# EAGLE schematic EasterRadio (EAGLE 9.6.1)

## Sheet 1 of 4
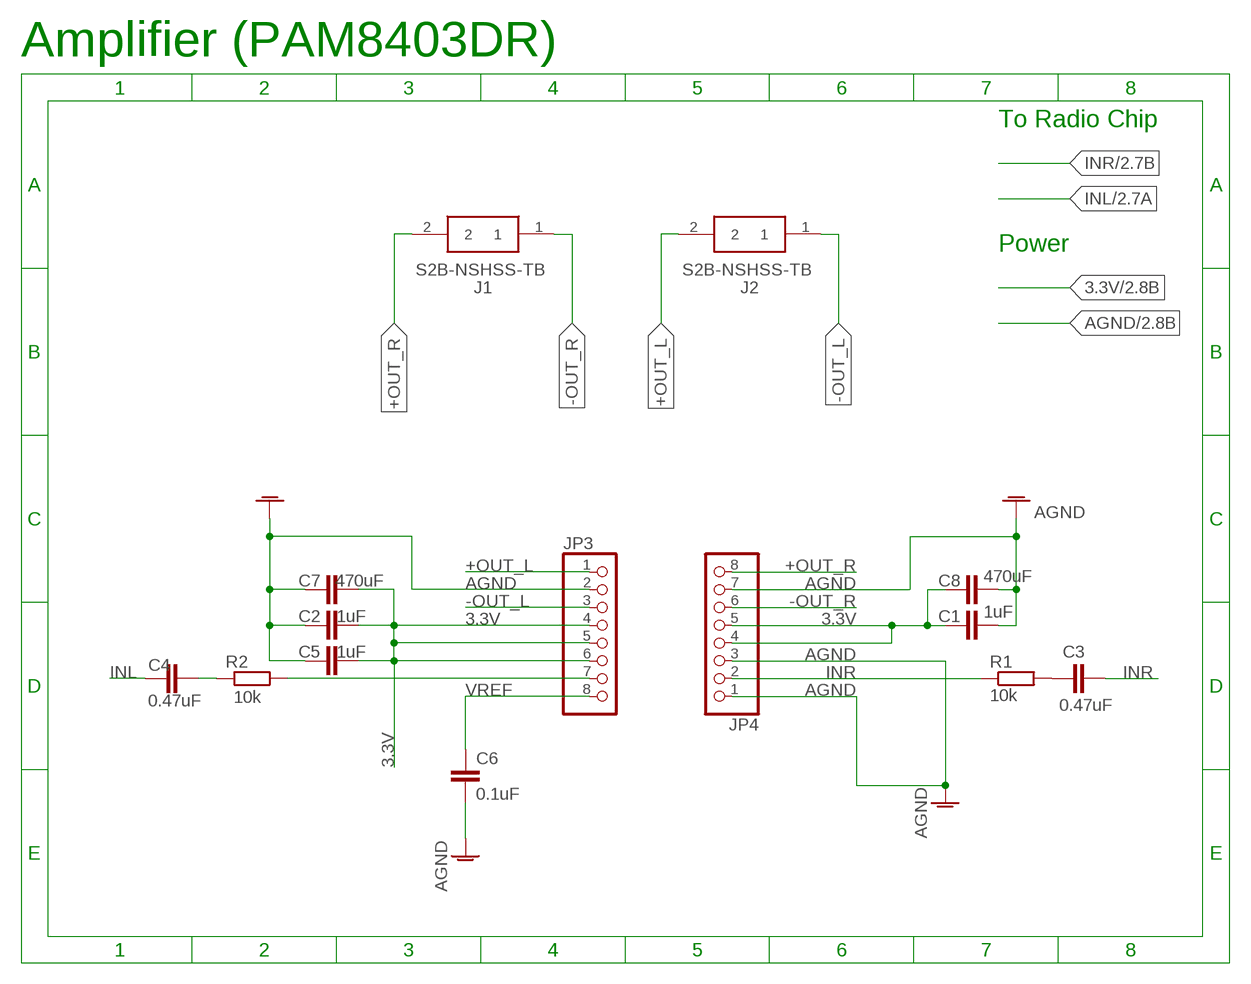
[diagram p0: schematic, sheet 1]

### Parts
C1  1uF  C-EU_805C0805  [C0805]
C2  1uF  C-EU_805C0805  [C0805]
C3  0.47uF  C-EU_805C0805  [C0805]
C4  0.47uF  C-EU_805C0805  [C0805]
C5  1uF  C-EU_805C0805  [C0805]
C6  0.1uF  C-EU_805C0805  [C0805]
C7  470uF  C-EU_805C0805  [C0805]
C8  470uF  C-EU_805C0805  [C0805]
J1  S2B-NSHSS-TB  [SM02B-NSHSS-TB]
J2  S2B-NSHSS-TB  [SM02B-NSHSS-TB]
JP3  PINHD-1X8  [1X08]
JP4  PINHD-1X8  [1X08]
R1  10k  R-EU_805R0805  [R0805]
R2  10k  R-EU_805R0805  [R0805]

### Nets
3.3V: C1.1 C2.2 C5.1 C7.1 C8.2 JP3.4 JP3.5 JP3.6 JP4.4 JP4.5 ; also sheet 2,3,4
+OUT_L: J2.2 JP3.1
+OUT_R: J1.2 JP4.8
-OUT_L: J2.1 JP3.3
-OUT_R: J1.1 JP4.6
AGND: C1.2 C2.1 C5.2 C6.2 C7.2 C8.1 JP3.2 JP4.1 JP4.3 JP4.7 ; also sheet 2,3,4
INL: C4.1 JP3.7 R2.1 ; also sheet 2
INR: C3.2 JP4.2 R1.1 ; also sheet 2
N$1: C3.1 R1.2
N$4: C4.2 R2.2
VREF: C6.1 JP3.8

### Notes on the sheet
- Amplifier (PAM8403DR)
- To Radio Chip
- Power

## Sheet 2 of 4
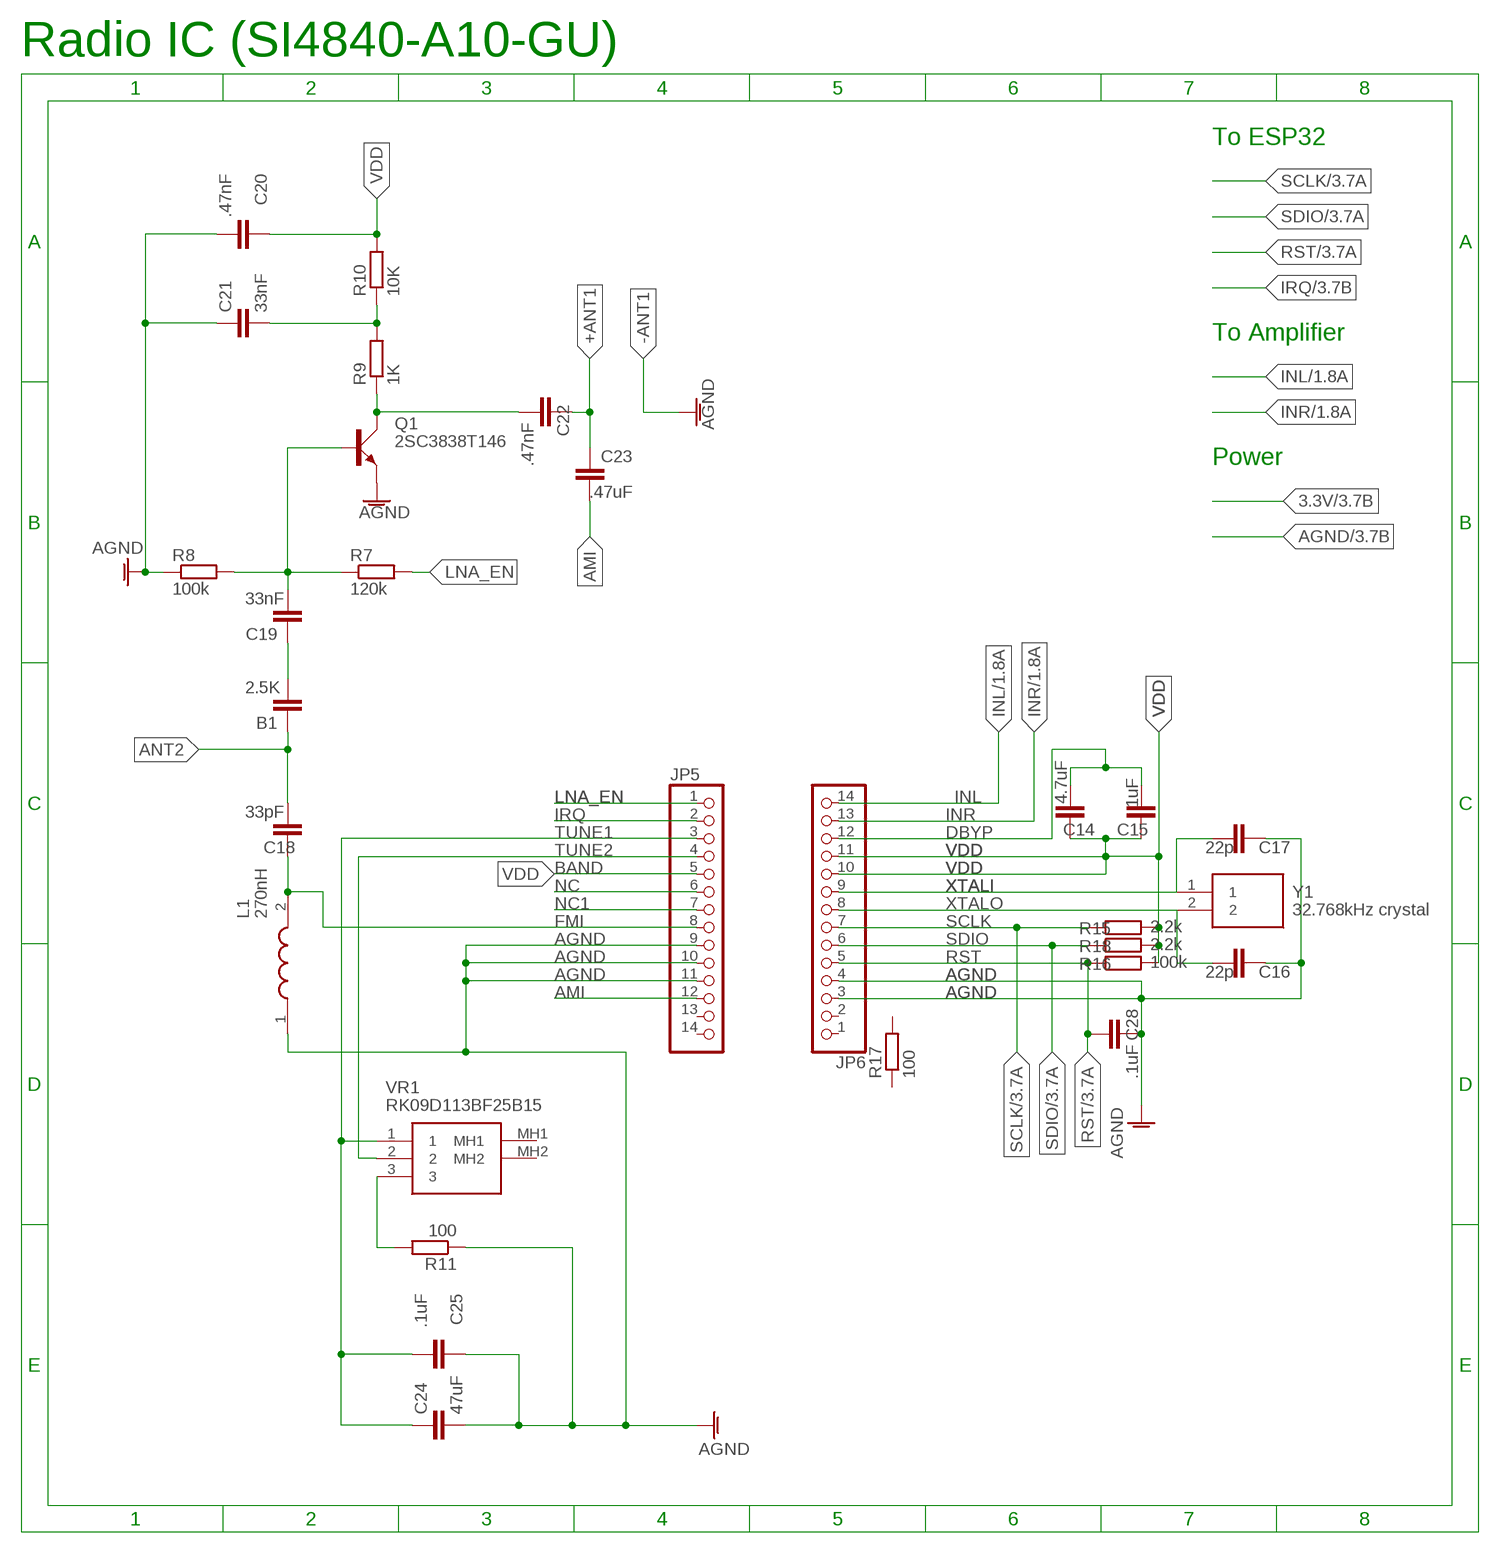
[diagram p1: schematic, sheet 2]

### Parts
B1  2.5K  C-EU_805C0805  [C0805]
C14  4.7uF  C-EU_1206C1206  [C1206]
C15  1uF  C-EU_805C0805  [C0805]
C16  22p  C-EU_805C0805  [C0805]
C17  22p  C-EU_805C0805  [C0805]
C18  33pF  C-EU_805C0805  [C0805]
C19  33nF  C-EU_1206C1206  [C1206]
C20  .47nF  C-EU_805C0805  [C0805]
C21  33nF  CNC5L1X7R1C106K160AEC1206  [C1206]
C22  .47nF  C-EU_805C0805  [C0805]
C23  .47uF  C-EU_805C0805  [C0805]
C24  47uF  CNC5L1X7R1C106K160AEC1206  [C1206]
C25  .1uF  C-EU_805C0805  [C0805]
C28  .1uF  C-EU_805C0805  [C0805]
JP5  PINHD-1X14  [1X14]
JP6  PINHD-1X14  [1X14]
L1  270nH  LQW2UASR56F0CL  [LQW2UAS12NG00L]
Q1  2SC3838T146  [SC59]
R7  120k  ERJ-PB6B5623VR0805  [R0805]
R8  100k  ERJ-PB6B5623VR0805  [R0805]
R9  1K  RCS1206100KJNEAR1206  [R1206]
R10  10K  RCS1206100KJNEAR1206  [R1206]
R11  100  ERJ-PB6B5623VR0805  [R0805]
R15  2.2k  ERJ-PB6B5623VR0805  [R0805]
R16  100k  ERJ-PB6B5623VR0805  [R0805]
R17  100  ERJ-PB6B5623VR0805  [R0805]
R18  2.2k  ERJ-PB6B5623VR0805  [R0805]
VR1  RK09D113BF25B15  [RK09D113BF25B15]
Y1  32.768kHz crystal  CM7V-T1A-32.768K-9PF-20PPM-TA-  [CM7VT1A32768KHZ125PF10PPMTBQC]

### Nets
+ANT1: C22.1 C23.1
AGND: C16.1 C17.1 C20.2 C21.1 C24.2 C25.1 C28.1 JP5.9 JP5.10 JP5.11 JP6.3 JP6.4 L1.1 Q1.E R8.1 R11.1 ; also sheet 1,3,4
AMI: C23.2 JP5.12
ANT2: B1.1 C18.2
BAND: JP5.5
DBYP: C14.2 C15.2 JP6.12
FMI: C18.1 JP5.8 L1.2
INL: JP6.14 ; also sheet 1
INR: JP6.13 ; also sheet 1
IRQ: JP5.2 ; also sheet 3
LNA_EN: JP5.1 R7.2
N$3: B1.2 C19.1
N$5: C19.2 Q1.B R7.1 R8.2
N$6: C22.2 Q1.C R9.1
N$7: C21.2 R9.2 R10.1
N$8: C20.1 R10.2
N$9: R11.2 VR1.3
NC: JP5.6
NC1: JP5.7
RST: C28.2 JP6.5 R16.1 ; also sheet 3
SCLK: JP6.7 R15.1 ; also sheet 3
SDIO: JP6.6 R18.1 ; also sheet 3
TUNE1: C24.1 C25.2 JP5.3 VR1.1
TUNE2: JP5.4 VR1.2
VDD: C14.1 C15.1 JP6.10 JP6.11 R15.2 R16.2 R18.2
XTALI: C17.2 JP6.9 Y1.1
XTALO: C16.2 JP6.8 Y1.2
Unconnected: JP5.13 JP5.14 JP6.1 JP6.2 R17.1 R17.2 VR1.MH1 VR1.MH2

### Notes on the sheet
- Radio IC (SI4840-A10-GU)
- To ESP32
- To Amplifier
- Power

## Sheet 3 of 4
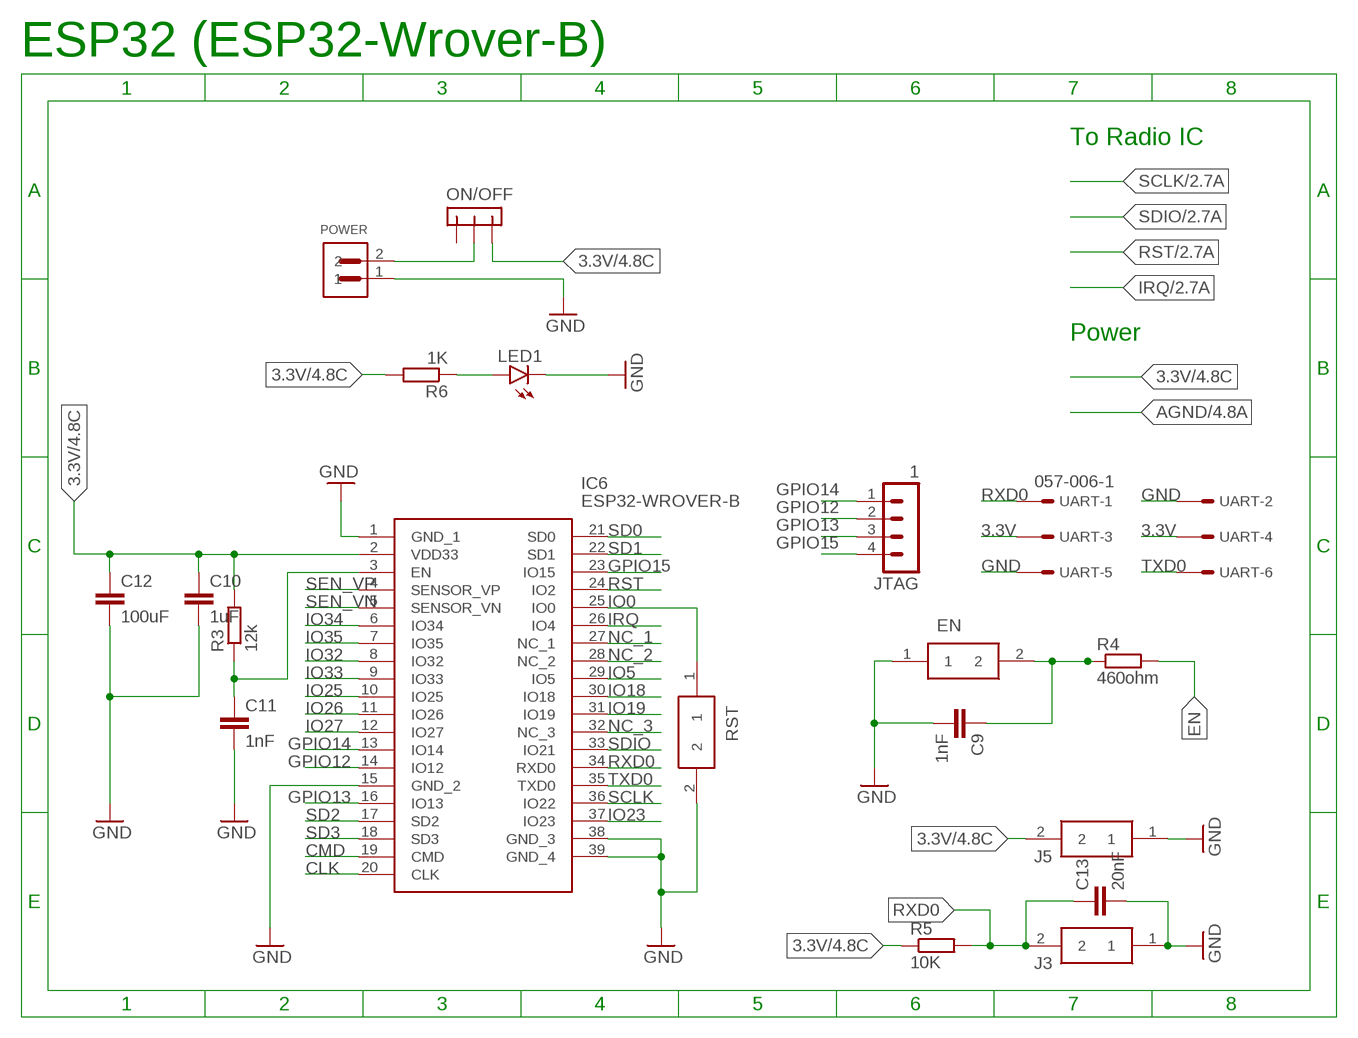
[diagram p2: schematic, sheet 3]

### Parts
C9  1nF  C-EU_805C0805  [C0805]
C10  1uF  C-EU_805C0805  [C0805]
C11  1nF  C-EU_805C0805  [C0805]
C12  100uF  C-EU_1206C1206  [C1206]
C13  20nF  C-EU_805C0805  [C0805]
EN  FSMSMTR  [FSMSM]
IC6  ESP32-WROVER-B  [ESP32WROVERIB16MB]
J3  S2B-NSHSS-TB  [SM02B-NSHSS-TB]
J5  S2B-NSHSS-TB  [SM02B-NSHSS-TB]
JTAG  1  MA04-1  [MA04-1]
LED1  LEDSMT1206  [1206]
ON/OFF  -CON3  [CON3]
POWER  S2B-PH-SM4-TB  [JST_S2B-PH-SM4-TB]
R3  12k  R-EU_805R0805  [R0805]
R4  460ohm  R-EU_805R0805  [R0805]
R5  10K  R-EU_1206R1206  [R1206]
R6  1K  R-EU_R1206  [R1206]
RST  FSMSMTR  [FSMSM]
UART  057-006-1  [057-006-1]

### Nets
3.3V: C10.1 C12.1 IC6.2(VDD33) J5.2 ON/OFF.P$1 R3.2 R5.1 R6.2 UART.3 UART.4 ; also sheet 1,2,4
CLK: IC6.20(CLK)
CMD: IC6.19(CMD)
EN [other]: C9.1 C11.1 EN.2 IC6.3(EN) R3.1 R4.1 R4.2
GND: C9.2 C10.2 C11.2 C12.2 C13.2 EN.1 IC6.1(GND_1) IC6.15(GND_2) IC6.38(GND_3) IC6.39(GND_4) J3.1 J5.1 LED1.C POWER.1 RST.2 UART.2 UART.5
GPIO12: IC6.14(IO12) JTAG.2
GPIO13: IC6.16(IO13) JTAG.3
GPIO14: IC6.13(IO14) JTAG.1
GPIO15: IC6.23(IO15) JTAG.4
IO0 [other]: IC6.25(IO0) RST.1
IO5: IC6.29(IO5)
IO18: IC6.30(IO18)
IO19: IC6.31(IO19)
IO23: IC6.37(IO23)
IO25: IC6.10(IO25)
IO26: IC6.11(IO26)
IO27: IC6.12(IO27)
IO32: IC6.8(IO32)
IO33: IC6.9(IO33)
IO34: IC6.6(IO34)
IO35: IC6.7(IO35)
IRQ: IC6.26(IO4) ; also sheet 2
N$2: ON/OFF.P$2 POWER.2
N$14 [other]: LED1.A R6.1
NC_1: IC6.27(NC_1)
NC_2: IC6.28(NC_2)
NC_3: IC6.32(NC_3)
RST: IC6.24(IO2) ; also sheet 2
RXD0 [other]: C13.1 IC6.34(RXD0) J3.2 R5.2 UART.1
SCLK: IC6.36(IO22) ; also sheet 2
SD0: IC6.21(SD0)
SD1: IC6.22(SD1)
SD2: IC6.17(SD2)
SD3: IC6.18(SD3)
SDIO: IC6.33(IO21) ; also sheet 2
SEN_VN: IC6.5(SENSOR_VN)
SEN_VP: IC6.4(SENSOR_VP)
TXD0 [other]: IC6.35(TXD0) UART.6
Unconnected: ON/OFF.P$3

### Notes on the sheet
- ESP32 (ESP32-Wrover-B)
- To Radio IC
- Power

## Sheet 4 of 4
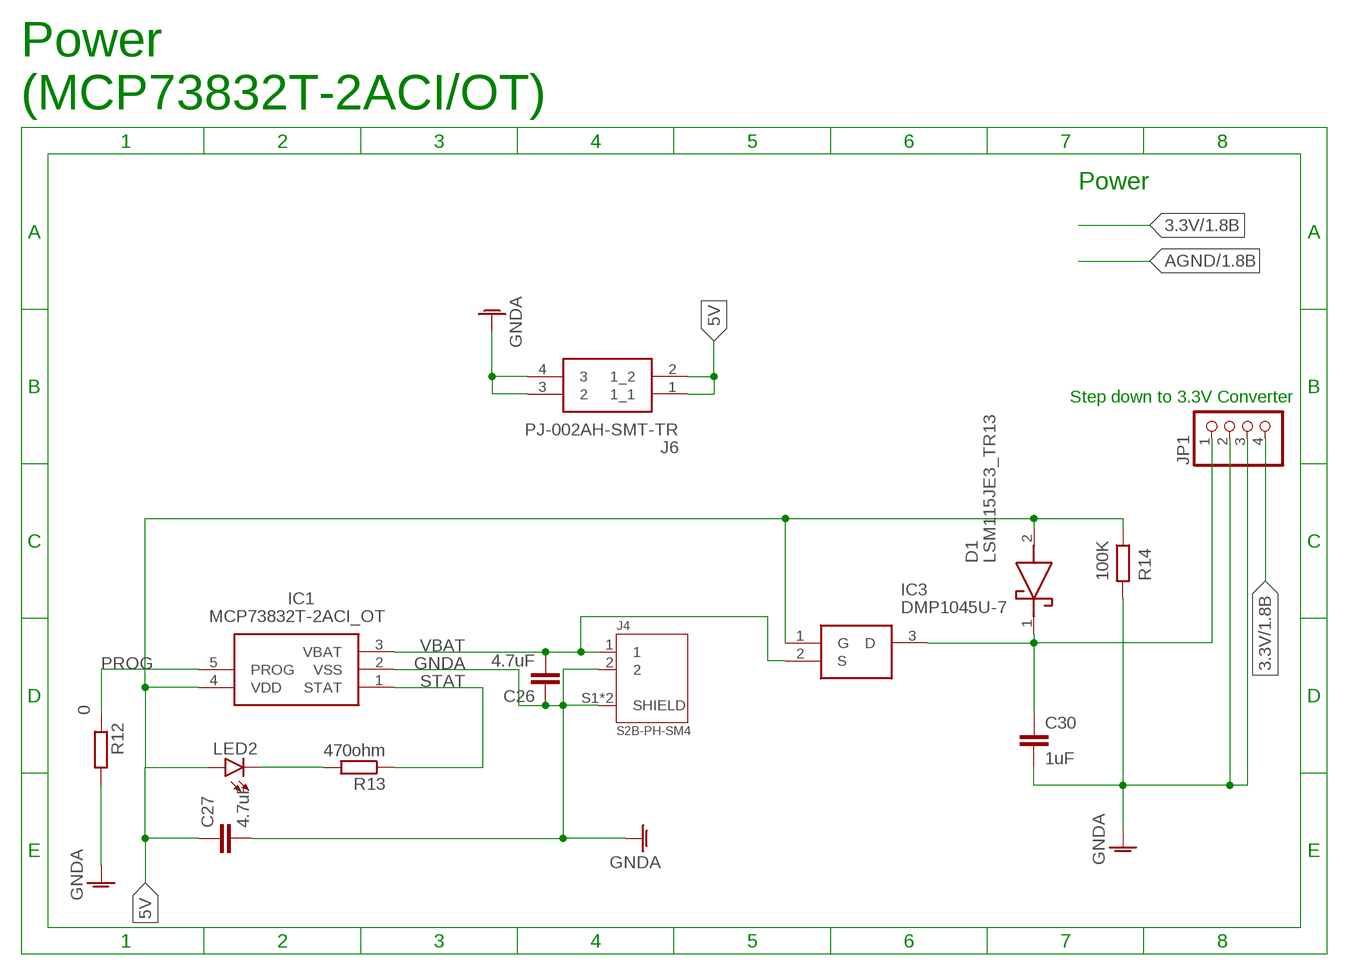
[diagram p3: schematic, sheet 4]

### Parts
C26  4.7uF  C-EU_1206C1206  [C1206]
C27  4.7uF  C-EU_1206C1206  [C1206]
C30  1uF  C-EU_805C0805  [C0805]
D1  LSM115JE3_TR13  [DIOM5436X330N]
IC1  MCP73832T-2ACI_OT  [SOT95P270X145-5N]
IC3  DMP1045U-7  [SOT96P240X100-3N]
J4  S2B-PH-SM4  [JST_S2B-PH-SM4-TB(LF)(SN)]
J6  PJ-002AH-SMT-TR  [PJ-002AH-SMT-TR]
JP1  PINHD-1X4  [1X04]
LED2  LED_1206SMT1206  [1206]
R12  0  R-EU_1206R1206  [R1206]
R13  470ohm  R-EU_1206R1206  [R1206]
R14  100K  R-EU_1206R1206  [R1206]

### Nets
3.3V: JP1.4 ; also sheet 1,2,3
5V: C27.1 D1.2(A) IC1.4(VDD) IC3.1(G) LED2.A R14.1
12V: C30.1 D1.1(K) IC3.3(D) J6.1(1_1) J6.2(1_2) JP1.1
GNDA: C26.1 C27.2 C30.2 IC1.2(VSS) J4.2 J4.S1(SHIELD) J4.S2(SHIELD) J6.3 J6.4 JP1.2 JP1.3 R12.2 R14.2
N$10: LED2.C R13.2
PROG: IC1.5(PROG) R12.1
STAT: IC1.1(STAT) R13.1
VBAT: C26.2 IC1.3(VBAT) IC3.2(S) J4.1

### Notes on the sheet
- Power
  (MCP73832T-2ACI/OT)
- Power
- Step down to 3.3V Converter

## Library data of the parts
B1 C1-C11 C13 C15-C18 C20 C22 C23 C25 C28 C30 = CommonParts:C-EU_805: CAPACITOR, European symbol; SPICEPREFIX: C
C12 C14 C19 C26 C27 = CommonParts:C-EU_1206: CAPACITOR, European symbol; SPICEPREFIX: C
C21 C24 = MouserUseful:CNC5L1X7R1C106K160AE: CAPACITOR, European symbol; MAX: 16V; SPICEPREFIX: C; VALUE: 10uF
D1 = CommonParts:LSM115JE3_TR13: Schottky Diodes & Rectifiers Schottky Source: Datasheet <https://componentsearchengine.com/Datasheets/1/LSM115JE3_TR13.pdf>; DESCRIPTION: Schottky Diodes & Rectifiers Schottky; HEIGHT: 3.3mm; MANUFACTURER_NAME: Microsemi Corporation; MANUFACTURER_PART_NUMBER: LSM115JE3/TR13; MOUSER_PART_NUMBER: 494-LSM115JE3/TR13; MOUSER_PRICE-STOCK: https://www.mouser.com/Search/Refine.aspx?Keyword=494-LSM115JE3%2FTR13
EN RST = FSMSMTR:FSMSMTR: Black Button Tact Switch, SPST 50 mA @ 24 V dc 1.07mm Source: Datasheet <http://www.te.com/commerce/DocumentDelivery/DDEController?Action=showdoc&DocId=Customer Drawing1437566-3C2pdfEnglishENG_CD_1437566-3_C2_1437566_3_1_c.dwg.pdf1437566-4>; ALLIED_NUMBER: 70286948; ALLIED_PRICE-STOCK: https://www.alliedelec.com/te-connectivity-fsmsmtr/70286948/; DESCRIPTION: Black Button Tact Switch, SPST 50 mA @ 24 V dc 1.07mm; HEIGHT: mm; MANUFACTURER_NAME: TE Connectivity; MANUFACTURER_PART_NUMBER: FSMSMTR; MOUSER_PART_NUMBER: 506-FSMSMTR; MOUSER_PRICE-STOCK: https://www.mouser.com/Search/Refine.aspx?Keyword=506-FSMSMTR; RS_PART_NUMBER: 1680547; RS_PRICE-STOCK: http://uk.rs-online.com/web/p/products/1680547
IC1 = MouserUseful:MCP73832T-2ACI_OT: Battery Charger Lithium-Ion, Lithium-Polymer Source: Datasheet <https://componentsearchengine.com/Datasheets/1/MCP73832T-2ACI_OT.pdf>; DESCRIPTION: Battery Charger Lithium-Ion, Lithium-Polymer; HEIGHT: 1.45mm; MANUFACTURER_NAME: Microchip; MANUFACTURER_PART_NUMBER: MCP73832T-2ACI/OT; MOUSER_PART_NUMBER: 579-MCP73832T-2ACIOT; MOUSER_PRICE-STOCK: https://www.mouser.com/Search/Refine.aspx?Keyword=579-MCP73832T-2ACIOT
IC3 = MouserUseful:DMP1045U-7: P-Channel Enhancement MOSFET SOT-23 Diodes Inc DMP1045U-7 P-channel MOSFET Transistor, 5.2 A, -12 V, 3-Pin SOT23 Source: Datasheet <https://componentsearchengine.com/Datasheets/1/DMP1045U-7.pdf>; DESCRIPTION: P-Channel Enhancement MOSFET SOT-23 Diodes Inc DMP1045U-7 P-channel MOSFET Transistor, 5.2 A, -12 V, 3-Pin SOT23; HEIGHT: 1mm; MANUFACTURER_NAME: Diodes Inc.; MANUFACTURER_PART_NUMBER: DMP1045U-7; MOUSER_PART_NUMBER: 621-DMP1045U-7; MOUSER_PRICE-STOCK: https://www.mouser.com/Search/Refine.aspx?Keyword=621-DMP1045U-7
IC6 = ESP32-WROVER-B:ESP32-WROVER-B: WiFi Modules (802.11) SMD Module, ESP32-D0WD, 64Mbits PSRAM, 32Mbits SPI flash, PCB Antenna Source: Datasheet <https://www.espressif.com/sites/default/files/documentation/esp32-wrover-b_datasheet_en.pdf>; DESCRIPTION: WiFi Modules (802.11) SMD Module, ESP32-D0WD, 64Mbits PSRAM, 32Mbits SPI flash, PCB Antenna; HEIGHT: mm; MANUFACTURER_NAME: Espressif Systems; MANUFACTURER_PART_NUMBER: ESP32-WROVER-B; MOUSER_PART_NUMBER: 356-ESP32-WROVER-B; MOUSER_PRICE-STOCK: https://www.mouser.com/Search/Refine.aspx?Keyword=356-ESP32-WROVER-B
J1-J3 J5 = CommonParts:S2B-NSHSS-TB: NSH 1.0mm SMT shrouded R/A PCB header,2P JST NSH Series, 1mm Pitch 2 Way 1 Row Shrouded Right Angle PCB Header, Surface Mount, Solder Termination Source: Datasheet <http://www.jst-mfg.com/product/pdf/eng/eNSH.pdf>; DESCRIPTION: NSH 1.0mm SMT shrouded R/A PCB header,2P JST NSH Series, 1mm Pitch 2 Way 1 Row Shrouded Right Angle PCB Header, Surface Mount, Solder Termination; HEIGHT: mm; MANUFACTURER_NAME: JST (JAPAN SOLDERLESS TERMINALS); MANUFACTURER_PART_NUMBER: SM02B-NSHSS-TB(LF)(SN)
J4 = CommonParts:S2B-PH-SM4: PH Series 2 Position 2 mm Pitch Surface Mount Side Entry Shrouded Header; DESCRIPTION: PH Series 2 Position 2 mm Pitch Surface Mount Side Entry Shrouded Header; DIGI-KEY_PART_NUMBER: 455-1749-1-ND; DIGI-KEY_PURCHASE_URL: https://www.digikey.com/product-detail/en/jst-sales-america-inc/S2B-PH-SM4-TB_LF__SN_/455-1749-1-ND/926846?utm_source=snapeda&utm_medium=aggregator&utm_campaign=symbol; MF: JST Sales; MP: S2B-PH-SM4-TB_LF__SN_; PACKAGE: None
J6 = CommonParts:PJ-002AH-SMT-TR: DC Power Connectors Power Jacks Source: Datasheet <https://componentsearchengine.com/Datasheets/1/PJ-002AH-SMT-TR.pdf>; DESCRIPTION: DC Power Connectors Power Jacks; HEIGHT: mm; MANUFACTURER_NAME: CUI; MANUFACTURER_PART_NUMBER: PJ-002AH-SMT-TR; MOUSER_PART_NUMBER: 490-PJ-002AH-SMT-TR; MOUSER_PRICE-STOCK: https://www.mouser.com/Search/Refine.aspx?Keyword=490-PJ-002AH-SMT-TR
JP1 = pinhead:PINHD-1X4: PIN HEADER
JP3 JP4 = pinhead:PINHD-1X8: PIN HEADER
JP5 JP6 = pinhead:PINHD-1X14: PIN HEADER
JTAG = con-lstb:MA04-1: PIN HEADER; OC_FARNELL: unknown; OC_NEWARK: unknown
L1 = MouserUseful:LQW2UASR56F0CL: LQW2UAS_0C Series Inductor 560nH +/-1% 1008 (2520) Source: Datasheet <https://componentsearchengine.com/Datasheets/1/LQW2UASR56F0CL.pdf>; DESCRIPTION: LQW2UAS_0C Series Inductor 560nH +/-1% 1008 (2520); HEIGHT: 2.03mm; MANUFACTURER_NAME: Murata Electronics; MANUFACTURER_PART_NUMBER: LQW2UASR56F0CL; MOUSER_PART_NUMBER: 81-LQW2UASR56F0CL; MOUSER_PRICE-STOCK: https://www.mouser.com/Search/Refine.aspx?Keyword=81-LQW2UASR56F0CL
LED1 = led:LED: LED OSRAM: - CHIPLED LG R971, LG N971, LY N971, LG Q971, LY Q971, LO R971, LY R971 LH N974, LH R974 LS Q976, LO Q976, LY Q976 LO Q996 - Hyper CHIPLED LW Q18S LB Q993, LB Q99A, LB R99A - SideLED LS A670, LO A670, LY A670, LG A670, LP A670 LB A673, LV A673, LT A673, LW A673 LH A674 LY A675 LS A676, LA A676, LO A676, LY A676, LW A676 LS A679, LY A679, LG A679 - Hyper Micro SIDELED® LS Y876, LA Y876, LO Y876, LY Y876 LT Y87S - SmartLED LW L88C, LW L88S LB L89C, LB L89S, LG L890 LS L89K, LO L89K, LY L89K LS L896, LA L896, LO L896, LY L896 - TOPLED LS T670, LO T670, LY T670, LG T670, LP T670 LSG T670, LSP T670, LSY T670, LOP T670, LYG T670 LG T671, LOG T671, LSG T671 LB T673, LV T673, LT T673, LW T673 LH T674 LS T676, LA T676, LO T676, LY T676, LB T676, LH T676, LSB T676, LW T676 LB T67C, LV T67C, LT T67C, LS T67K, LO T67K, LY T67K, LW E67C LS E67B, LA E67B, LO E67B, LY E67B, LB E67C, LV E67C, LT E67C LW T67C LS T679, LY T679, LG T679 LS T770, LO T770, LY T770, LG T770, LP T770 LB T773, LV T773, LT T773, LW T773 LH T774 LS E675, LA E675, LY E675, LS T675 LS T776, LA T776, LO T776, LY T776, LB T776 LHGB T686 LT T68C, LB T68C - Hyper Mini TOPLED® LB M676 - Mini TOPLED Santana® LG M470 LS M47K, LO M47K, LY M47K Source: http://www.osram.convergy.de LUXEON: - LUMILED® LXK2-PW12-R00, LXK2-PW12-S00, LXK2-PW14-U00, LXK2-PW14-V00 LXK2-PM12-R00, LXK2-PM12-S00, LXK2-PM14-U00 LXK2-PE12-Q00, LXK2-PE12-R00, LXK2-PE12-S00, LXK2-PE14-T00, LXK2-PE14-U00 LXK2-PB12-K00, LXK2-PB12-L00, LXK2-PB12-M00, LXK2-PB14-N00, LXK2-PB14-P00, LXK2-PB14-Q00 LXK2-PR12-L00, LXK2-PR12-M00, LXK2-PR14-Q00, LXK2-PR14-R00 LXK2-PD12-Q00, LXK2-PD12-R00, LXK2-PD12-S00 LXK2-PH12-R00, LXK2-PH12-S00 LXK2-PL12-P00, LXK2-PL12-Q00, LXK2-PL12-R00 Source: www.luxeon.com KINGBRIGHT: KA-3528ASYC Source: www.kingbright.com
LED2 = CommonParts:LED_1206: LED OSRAM: - CHIPLED LG R971, LG N971, LY N971, LG Q971, LY Q971, LO R971, LY R971 LH N974, LH R974 LS Q976, LO Q976, LY Q976 LO Q996 - Hyper CHIPLED LW Q18S LB Q993, LB Q99A, LB R99A - SideLED LS A670, LO A670, LY A670, LG A670, LP A670 LB A673, LV A673, LT A673, LW A673 LH A674 LY A675 LS A676, LA A676, LO A676, LY A676, LW A676 LS A679, LY A679, LG A679 - Hyper Micro SIDELED® LS Y876, LA Y876, LO Y876, LY Y876 LT Y87S - SmartLED LW L88C, LW L88S LB L89C, LB L89S, LG L890 LS L89K, LO L89K, LY L89K LS L896, LA L896, LO L896, LY L896 - TOPLED LS T670, LO T670, LY T670, LG T670, LP T670 LSG T670, LSP T670, LSY T670, LOP T670, LYG T670 LG T671, LOG T671, LSG T671 LB T673, LV T673, LT T673, LW T673 LH T674 LS T676, LA T676, LO T676, LY T676, LB T676, LH T676, LSB T676, LW T676 LB T67C, LV T67C, LT T67C, LS T67K, LO T67K, LY T67K, LW E67C LS E67B, LA E67B, LO E67B, LY E67B, LB E67C, LV E67C, LT E67C LW T67C LS T679, LY T679, LG T679 LS T770, LO T770, LY T770, LG T770, LP T770 LB T773, LV T773, LT T773, LW T773 LH T774 LS E675, LA E675, LY E675, LS T675 LS T776, LA T776, LO T776, LY T776, LB T776 LHGB T686 LT T68C, LB T68C - Hyper Mini TOPLED® LB M676 - Mini TOPLED Santana® LG M470 LS M47K, LO M47K, LY M47K Source: http://www.osram.convergy.de LUXEON: - LUMILED® LXK2-PW12-R00, LXK2-PW12-S00, LXK2-PW14-U00, LXK2-PW14-V00 LXK2-PM12-R00, LXK2-PM12-S00, LXK2-PM14-U00 LXK2-PE12-Q00, LXK2-PE12-R00, LXK2-PE12-S00, LXK2-PE14-T00, LXK2-PE14-U00 LXK2-PB12-K00, LXK2-PB12-L00, LXK2-PB12-M00, LXK2-PB14-N00, LXK2-PB14-P00, LXK2-PB14-Q00 LXK2-PR12-L00, LXK2-PR12-M00, LXK2-PR14-Q00, LXK2-PR14-R00 LXK2-PD12-Q00, LXK2-PD12-R00, LXK2-PD12-S00 LXK2-PH12-R00, LXK2-PH12-S00 LXK2-PL12-P00, LXK2-PL12-Q00, LXK2-PL12-R00 Source: www.luxeon.com KINGBRIGHT: KA-3528ASYC Source: www.kingbright.com
ON/OFF = tango:-CON3
POWER = S2B-PH-SM4-TB:S2B-PH-SM4-TB: CONN HEADER PH SIDE 2POS 2MM SMD; AVAILABILITY: Unavailable; DESCRIPTION: Socket; wire-board; male; PIN: 2; 2mm; SMT; PH; 100V; 2A; -25÷85°C; MF: JST Sales; MP: S2B-PH-SM4-TB; PACKAGE: None; PRICE: None
Q1 = transistor-small-signal:2SC3838: High-Frequency Amplifier Transistor 11V, 50mA, 3.2GHz (Rohm)
R1-R4 = CommonParts:R-EU_805: RESISTOR, European symbol
R5 R12-R14 = CommonParts:R-EU_1206: RESISTOR, European symbol
R6 = rcl:R-EU_: RESISTOR, European symbol; SPICEPREFIX: R
R7 R8 R11 R15-R18 = MouserUseful:ERJ-PB6B5623V: RESISTOR, European symbol; VALUE: 562kOhm
R9 R10 = MouserUseful:RCS1206100KJNEA: RESISTOR, European symbol; SPICEPREFIX: R; VALUE: 100kOhm; WATT: 0.5
UART = con-panduit:057-006-: CONNECTOR 6-pin series 057 contact pc board low profile headers; OC_FARNELL: unknown; OC_NEWARK: unknown
VR1 = MouserUseful:RK09D113BF25B15: Potentiometers V/ADJ 100K 25MM SHFT Source: Datasheet <https://componentsearchengine.com/Datasheets/1/RK09D113BF25B15.pdf>; DESCRIPTION: Potentiometers V/ADJ 100K 25MM SHFT; HEIGHT: 20mm; MANUFACTURER_NAME: ALPS; MANUFACTURER_PART_NUMBER: RK09D113BF25B15; MOUSER_PART_NUMBER: 688-RK09D113BF25B15; MOUSER_PRICE-STOCK: https://www.mouser.com/Search/Refine.aspx?Keyword=688-RK09D113BF25B15
Y1 = MouserUseful:CM7V-T1A-32.768K-9PF-20PPM-TA-: Crystals 32.768 kHz 9.0 pF +/-20 PPM AEC-Q200 Source: Datasheet <https://componentsearchengine.com/Datasheets/1/CM7V-T1A-32.768k-9pF-20PPM-TA-QA T3.pdf>; DESCRIPTION: Crystals 32.768 kHz 9.0 pF +/-20 PPM AEC-Q200; HEIGHT: 0.65mm; MANUFACTURER_NAME: MICRO CRYSTAL; MANUFACTURER_PART_NUMBER: CM7V-T1A-32.768k-9pF-20PPM-TA-QA T3; MOUSER_PART_NUMBER: 428-201568-MG03; MOUSER_PRICE-STOCK: https://www.mouser.com/Search/Refine.aspx?Keyword=428-201568-MG03

## Net classes
0 default: clearance 0.205 mm
1 other: width 0.2 mm, drill 0.2 mm, clearance 0.205 mm to class 0, clearance 0.205 mm